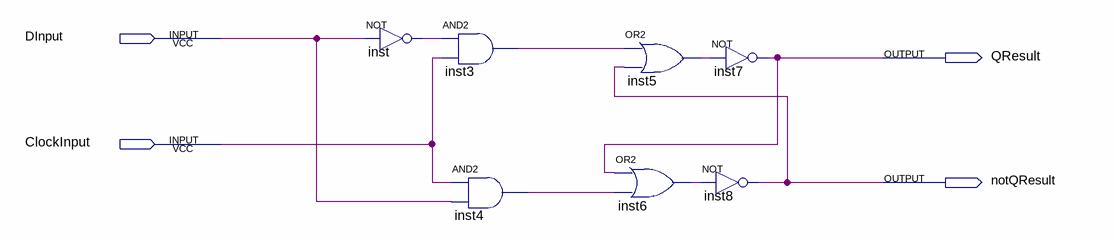
[diagram p0: schematic sheet]
// Quartus schematic dflipflop.bdf as structural Verilog: 7 symbols, 4 pins
module dflipflop (
  input  DInput,
  input  ClockInput,
  output QResult,
  output notQResult
);

  wire inst3_out, inst4_out, inst5_out, inst6_out, inst_out;

  not inst (inst_out, DInput);
  and inst3 (inst3_out, inst_out, ClockInput);
  and inst4 (inst4_out, ClockInput, DInput);
  or inst5 (inst5_out, inst3_out, notQResult);
  or inst6 (inst6_out, QResult, inst4_out);
  not inst7 (QResult, inst5_out);
  not inst8 (notQResult, inst6_out);
endmodule
